# EAGLE design tdt_maleToMale (EAGLE 8.1.0)
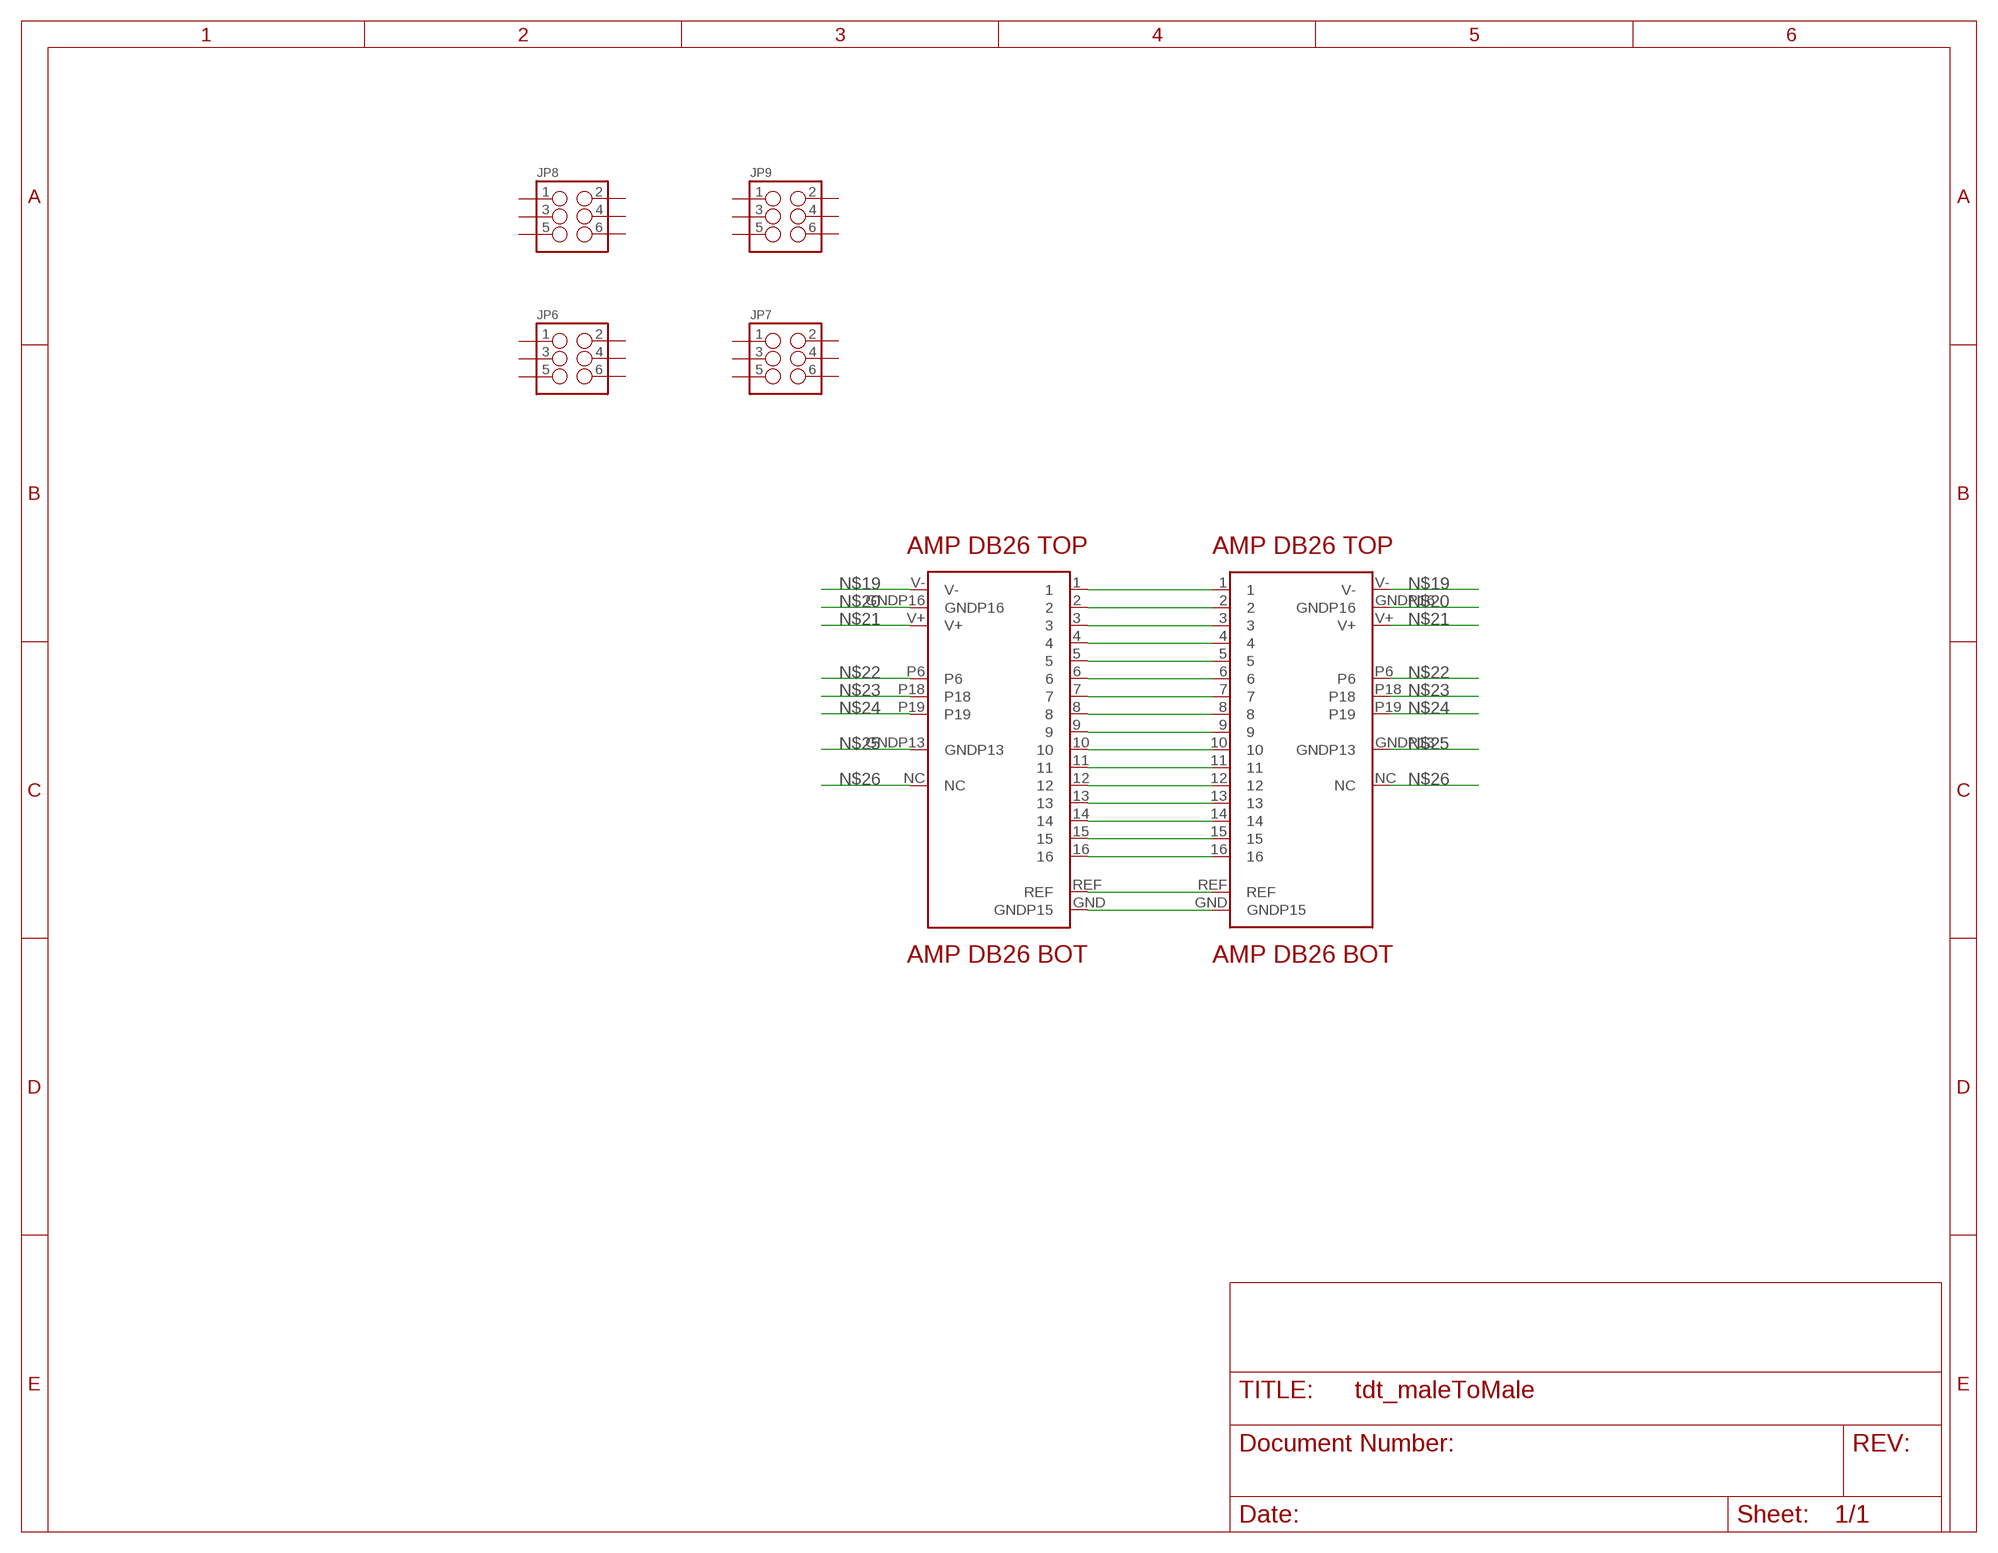
[diagram p0: schematic, sheet 1]

## Parts
JP6  M03X22X3_SILK_MALE_PTH  [2X3]
JP7  M03X22X3_SILK_MALE_PTH  [2X3]
JP8  M03X22X3_SILK_MALE_PTH  [2X3]
JP9  M03X22X3_SILK_MALE_PTH  [2X3]
U$1  DB26-MALE-BOT  [DB26-MALE-BOT]
U$2  DB26-MALE-TOP  [DB26-MALE-TOP]
U$3  DB26-MALE-TOP  [DB26-MALE-TOP]
U$4  DB26-MALE-BOT  [DB26-MALE-BOT]

## Nets
N$1: U$2.1 U$3.1
N$2: U$2.2 U$3.2
N$3: U$2.3 U$3.3
N$4: U$2.4 U$3.4
N$5: U$2.5 U$3.5
N$6: U$2.REF U$3.REF
N$7: U$2.7 U$3.7
N$8: U$2.9 U$3.9
N$9: U$2.11 U$3.11
N$10: U$2.13 U$3.13
N$11: U$2.15 U$3.15
N$12: U$1.8 U$4.8
N$13: U$1.16 U$4.16
N$14: U$1.GND(GNDP15) U$4.GND(GNDP15)
N$15: U$1.6 U$4.6
N$16: U$1.10 U$4.10
N$17: U$1.12 U$4.12
N$18: U$1.14 U$4.14
N$19: U$1.V- U$4.V-
N$20: U$1.GNDP16 U$4.GNDP16
N$21: U$1.V+ U$4.V+
N$22: U$2.P6 U$3.P6
N$23: U$1.P18 U$4.P18
N$24: U$1.P19 U$4.P19
N$25: U$2.GNDP13 U$3.GNDP13
N$26: U$1.NC U$4.NC
Unconnected: JP6.1 JP6.2 JP6.3 JP6.4 JP6.5 JP6.6 JP7.1 JP7.2 JP7.3 JP7.4 JP7.5 JP7.6 JP8.1 JP8.2 JP8.3 JP8.4 JP8.5 JP8.6 JP9.1 JP9.2 JP9.3 JP9.4 JP9.5 JP9.6

## Library data of the parts
JP6-JP9 = SparkFun-Connectors:M03X2: 2x3 .1" header. Shrouded, with keying- CONN-10681 SMT- CONN-11415 Pogo pins- HW-11044; PROD_ID: CONN-09701
U$1 U$4 = HDMI-DB26:DB26-MALE-BOT
U$2 U$3 = HDMI-DB26:DB26-MALE-TOP

## Board
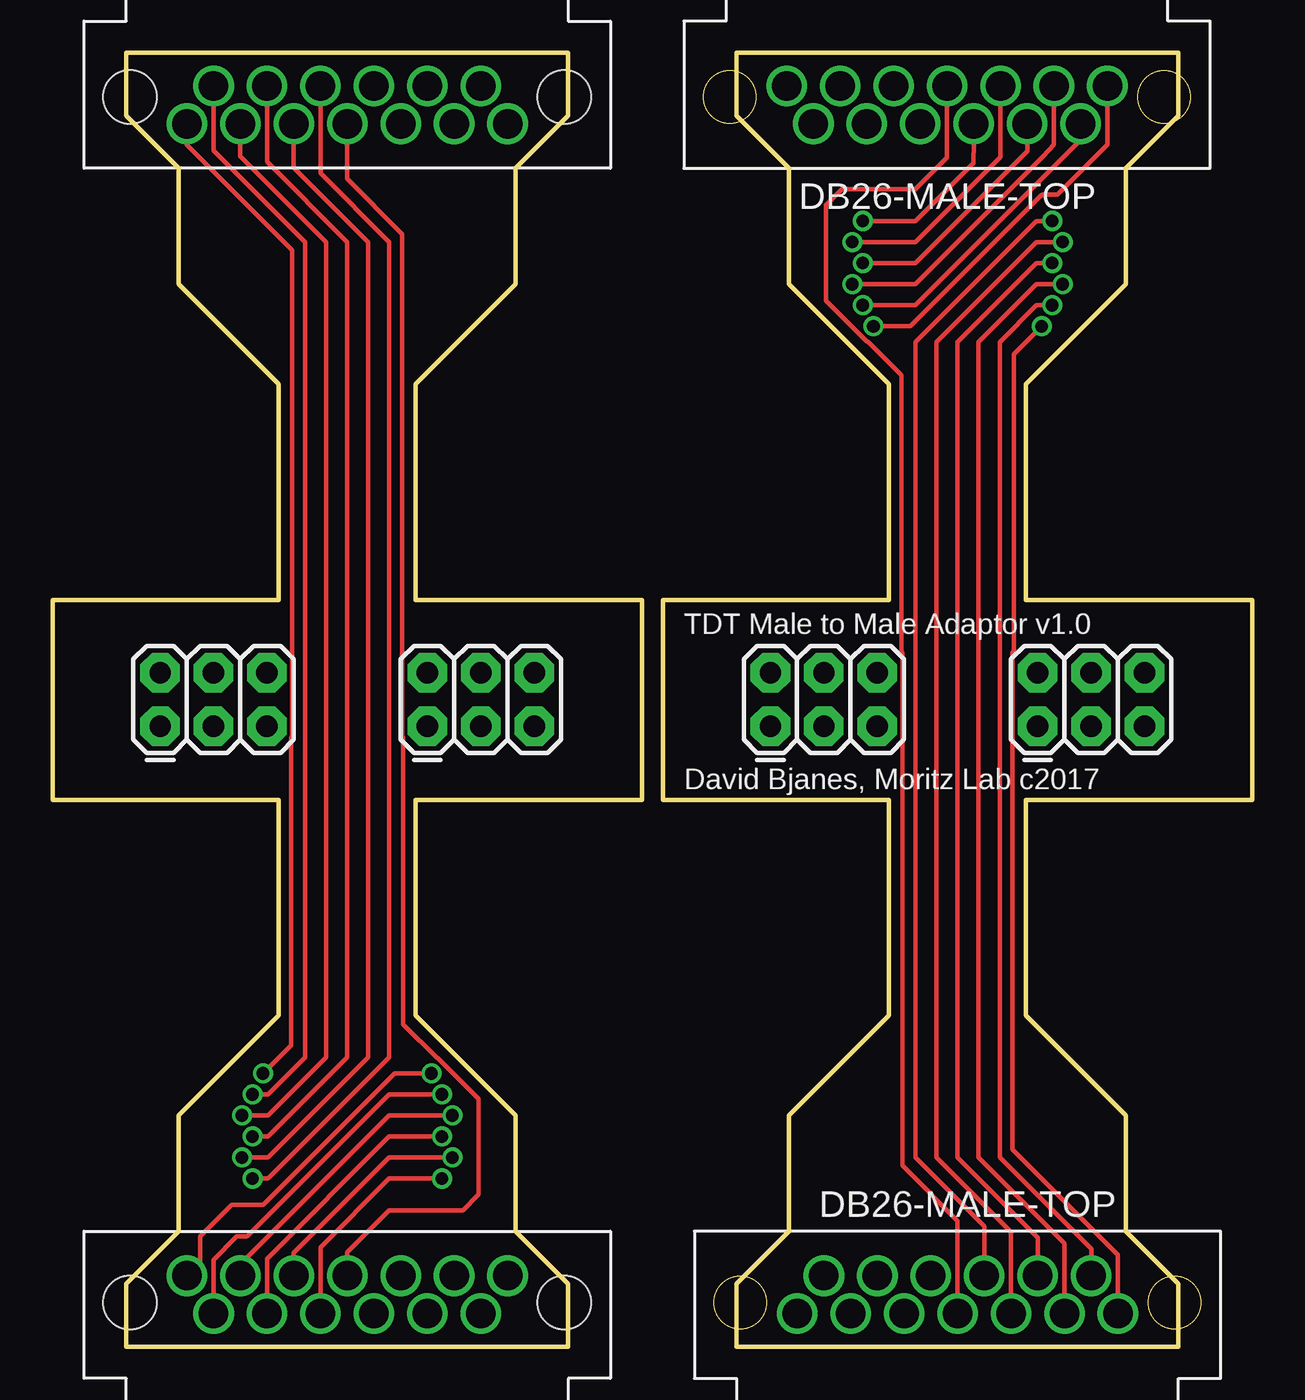
[diagram p1: board, top side]
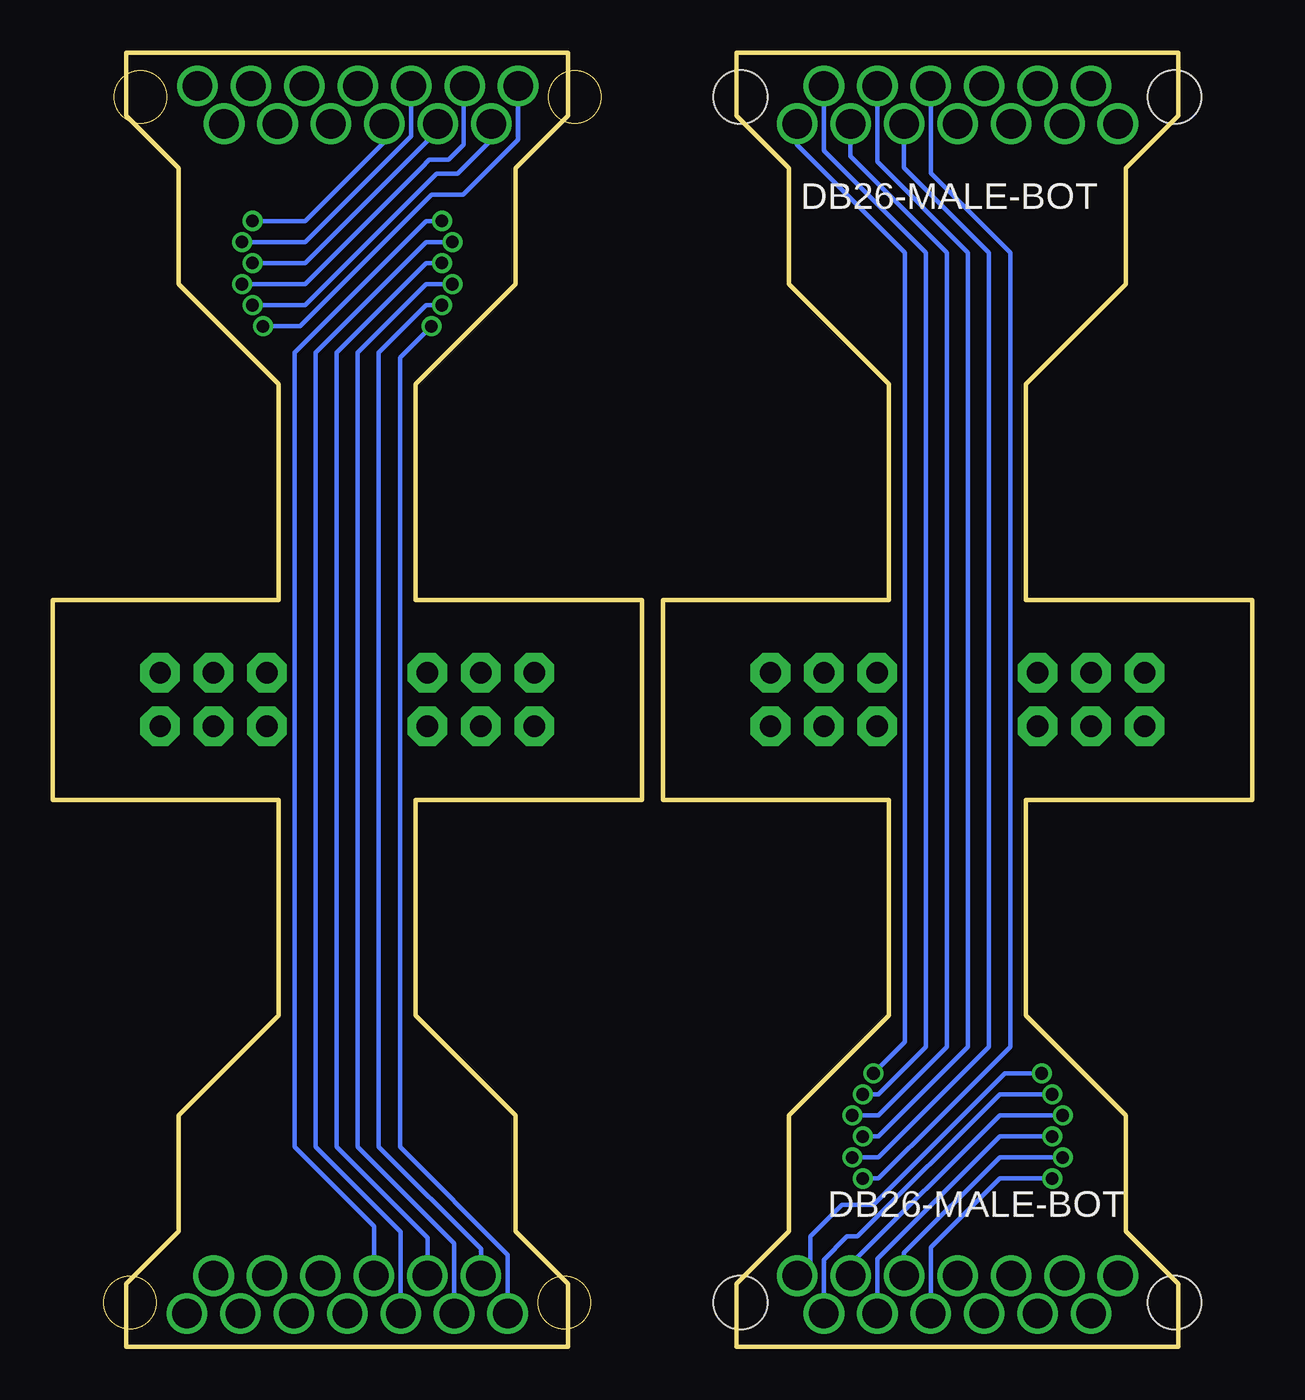
[diagram p2: board, bottom side, seen from below]

Size 57 x 61.5 mm. Coordinates in mm from the lower left corner, seen from the top.
Outline: 28,26 28,35.5 17.25,35.5 17.25,45.75 22,50.5 22,56 24.5,58.5 24.5,61.5 3.5,61.5 3.5,58.5 6,56 6,50.5 10.75,45.75 10.75,35.5 0,35.5 0,26 10.75,26 10.75,15.75 6,11 6,5.5 3.5,3 3.5,0 24.5,0 24.5,3 22,5.5 22,11 17.25,15.75 17.25,26 28,26
Outline: 53.5,0 32.5,0 32.5,3 35,5.5 35,11 39.75,15.75 39.75,26 29,26 29,35.5 39.75,35.5 39.75,45.75 35,50.5 35,56 32.5,58.5 32.5,61.5 53.5,61.5 53.5,58.5 51,56 51,50.5 46.25,45.75 46.25,35.5 57,35.5 57,26 46.25,26 46.25,15.75 51,11 51,5.5 53.5,3 53.5,0
Copper layers (1*16): Top 0.0356mm / dielectric 1.5011mm / Bottom 0.0356mm
Design rules "oshpark-2layer *": minimum track width 6mil, minimum drill 13mil, track to track 6mil, track to pad 6mil, pad to pad 6mil, via to via 6mil, smd to smd 6mil, copper to edge 15mil, drill to drill 6mil, minimum pad ring 7mil, minimum via ring 7mil, stop-mask expansion 2.5mil, vias tented up to drill 0mil, thermal gap 10mil

### Footprints (pad centres in the part's own frame; a part is rotated, then mirrored left to right if it is on the bottom)
2X3 = drill 1.016 pad 1.88 octagon: 1 0,0; 2 0,2.54; 3 2.54,0; 4 2.54,2.54; 5 5.08,0; 6 5.08,2.54
DB26-MALE-BOT = drill 1.4 pad 1.93: 6 0,2.12; 8 -1.27,3.92; 10 -2.54,2.12; 12 -3.81,3.92; 14 -5.08,2.12; 16 -6.35,3.92; GND 6.35,3.92; GNDP16 5.08,2.12; NC -7.62,2.12; P18 2.54,2.12; P19 1.27,3.92; V+ 7.62,2.12; V- 3.81,3.92 | hole 2.54: 10.316,3.394; -10.316,3.394
DB26-MALE-TOP = drill 1.4 pad 1.93: 1 7.62,3.92; 2 6.35,2.12; 3 5.08,3.92; 4 3.81,2.12; 5 0,3.92; 7 -1.27,2.12; 9 -2.54,3.92; 11 -3.81,2.12; 13 -5.08,3.92; 15 -6.35,2.12; GNDP13 -7.62,3.92; P6 1.27,2.12; REF 2.54,3.92

### Placement (x,y rotation side)
JP6  34.11,29.5 0 top
JP7  46.81,29.5 0 top
JP8  5.11,29.5 0 top
JP9  17.81,29.5 0 top
U$1  14,5.5 180 top
U$2  43,5.5 180 top
U$3  42.5,56 0 top
U$4  14,56 0 top

### Tracks (layer width: path | path; a pad name or v marks a point on that pad's centre or on a via)
N$1  (via drill 0.6)
  Top 0.203: v39,48.5 40.75,48.5 47,54.75 47.75,54.75 50.12,57.12 U$3.1 50.07,59.87
  Bottom 0.203: v39,48.5 40.5,47 40.5,9.5 35.38,4.38 U$2.1
N$2  (via drill 0.6)
  Top 0.203: 39.23,49.5 v38.5,49.5 41,49.5 48.85,57.35 U$3.2
  Bottom 0.203: v38.5,49.5 39.25,49.5 41.5,47.25 41.5,9.5 36.65,4.65 U$2.2
N$3  (via drill 0.6)
  Top 0.203: 38.73,50.5 v38,50.5 41,50.5 47.08,56.58 47.58,57.12 U$3.3
  Bottom 0.203: v38,50.5 39.25,50.5 42.5,47.25 42.5,9.5 37.92,4.92 U$2.3
N$4  (via drill 0.6)
  Top 0.203: v38.5,51.5 41,51.5 46.31,56.81 U$3.4
  Bottom 0.203: v38.5,51.5 39.25,51.5 43.5,47.25 43.5,9.5 39.19,5.19 U$2.4
N$5
  Top 0.203: U$3.5 42.5,56.5 41,55 37.5,55 36.75,54.25 36.75,49.72 38.7,47.77 38.73,47.77 40.33,46.17 40.33,33.04 40.38,32.99 40.38,8.62 43,6 U$2.5
N$6  (via drill 0.6)
  Top 0.203: v38,52.5 41,52.5 45.04,56.54 U$3.REF
  Bottom 0.203: v38,52.5 39.25,52.5 44.5,47.25 44.5,9.5 40.46,5.46 U$2.REF
N$7  (via drill 0.6)
  Top 0.203: v47.5,53.5 46.75,53.5 41,47.75 41,9 44.27,5.73 U$2.7
  Bottom 0.203: v47.5,53.5 45,53.5 41.23,57.27 U$3.7
N$8  (via drill 0.6)
  Top 0.203: v48,52.5 46.75,52.5 42,47.75 42,9 45.54,5.46 U$2.9
  Bottom 0.203: v48,52.5 45,52.5 39.96,57.54 U$3.9
N$9  (via drill 0.6)
  Top 0.203: v47.5,51.5 46.75,51.5 43,47.75 43,9 46.81,5.19 U$2.11
  Bottom 0.203: 39.19,57.31 39.5,57 | 39.5,57 45,51.5 v47.5,51.5 | 39.5,57 38.69,57.81 U$3.11
N$10  (via drill 0.6)
  Top 0.203: v48,50.5 46.75,50.5 44,47.75 44,9 48.08,4.92 U$2.13
  Bottom 0.203: v48,50.5 45,50.5 39.5,56 39.1,56.4 38.19,56.4 37.47,57.12 37.47,59.87 U$3.13
N$11  (via drill 0.6)
  Top 0.203: v47.5,49.5 46.75,49.5 45,47.75 45,9 49.35,4.65 U$2.15
  Bottom 0.203: v47.5,49.5 45,49.5 38.75,55.75 37.75,55.75 36.15,57.35 U$3.15
N$12  (via drill 0.6)
  Top 0.203: v9.5,8 10.25,8 16,13.75 16,52.5 12.73,55.77 U$4.8
  Bottom 0.203: U$1.8 15.27,4.73 12,8 v9.5,8
N$13  (via drill 0.6)
  Top 0.203: v9.5,12 10.25,12 12,13.75 12,52.5 7.65,56.85 U$4.16
  Bottom 0.203: v9.5,12 12,12 18.75,5.25 19.25,5.25 20.35,4.15 U$1.16
N$14  (via drill 0.6)
  Top 0.203: U$1.GND 7.65,4.15 8.75,5.25 9.25,5.25 16,12 v18.5,12 17.77,12
  Bottom 0.203: v18.5,12 17.75,12 15.5,14.25 15.5,52 20.35,56.85 U$4.GND
N$15
  Top 0.203: U$1.6 14,4.5 16,6.5 19.5,6.5 20.25,7.25 20.25,11.79 18.3,13.73 18.27,13.73 16.67,15.33 16.67,28.96 16.62,29.01 16.62,52.88 14,55.5 U$4.6
N$16  (via drill 0.6)
  Top 0.203: v9,9 10.25,9 15,13.75 15,52.5 11.46,56.04 U$4.10
  Bottom 0.203: U$1.10 16.54,4.46 12,9 v9,9
N$17  (via drill 0.6)
  Top 0.203: v9.5,10 10.25,10 14,13.75 14,52.5 10.19,56.31 U$4.12
  Bottom 0.203: U$1.12 17.81,4.19 12,10 v9.5,10
N$18  (via drill 0.6)
  Top 0.203: v9,11 10.25,11 13,13.75 13,52.5 8.92,56.58 U$4.14
  Bottom 0.203: U$1.14 19.08,3.92 12,11 v9,11
N$19  (via drill 0.6)
  Top 0.203: U$1.V- 10.19,4.19 16,10 v18.5,10
  Bottom 0.203: v18.5,10 17.75,10 13.5,14.25 13.5,52 17.81,56.31 U$4.V-
N$20  (via drill 0.6)
  Top 0.203: U$1.GNDP16 8.92,3.92 16,11 v19,11 18.27,11
  Bottom 0.203: v19,11 17.75,11 14.5,14.25 14.5,52 19.08,56.58 U$4.GNDP16
N$21  (via drill 0.6)
  Top 0.203: 6.75,3.75 U$1.V+ 7,4 7,5.25 8.5,6.75 10,6.75 16.25,13 v18,13
  Bottom 0.203: v18,13 16.5,14.5 16.5,52 21.62,57.12 U$4.V+
N$22  (via drill 0.6)
  Top 0.203: 38.23,53.5 v38.5,53.5 41,53.5 43.75,56.25 43.77,57.23 U$3.P6
  Bottom 0.203: v38.5,53.5 39.25,53.5 42.25,50.5 45.5,47.25 45.5,9.5 41.73,5.73 U$2.P6
N$23  (via drill 0.6)
  Top 0.203: U$1.P18 11.46,4.46 16,9 v19,9
  Bottom 0.203: v19,9 17.75,9 12.5,14.25 12.5,52 16.54,56.04 U$4.P18
N$24  (via drill 0.6)
  Top 0.203: U$1.P19 12.73,4.73 16,8 v18.5,8 18.77,8
  Bottom 0.203: v18.5,8 17.75,8 14.75,11 11.5,14.25 11.5,52 15.27,55.77 U$4.P19
N$25  (via drill 0.6)
  Top 0.203: v47,48.5 45.67,47.17 45.67,33.04 45.62,32.99 45.62,9.38 50.62,4.38 U$2.GNDP13
  Bottom 0.203: v47,48.5 45.25,48.5 39,54.75 37.5,54.75 36.12,56.12 36,56.25 34.88,57.37 U$3.GNDP13
N$26  (via drill 0.6)
  Top 0.203: v10,13 11.33,14.33 11.33,28.96 11.38,29.01 11.38,52.12 6.38,57.12 U$4.NC
  Bottom 0.203: v10,13 11.75,13 18,6.75 19.5,6.75 21,5.25 21,4 U$1.NC

### Text on the board
tNames: TDT Male to Male Adaptor v1.0 | David Bjanes, Moritz Lab c2017